# EAGLE design dwm1000v2 (EAGLE 8.3.2)
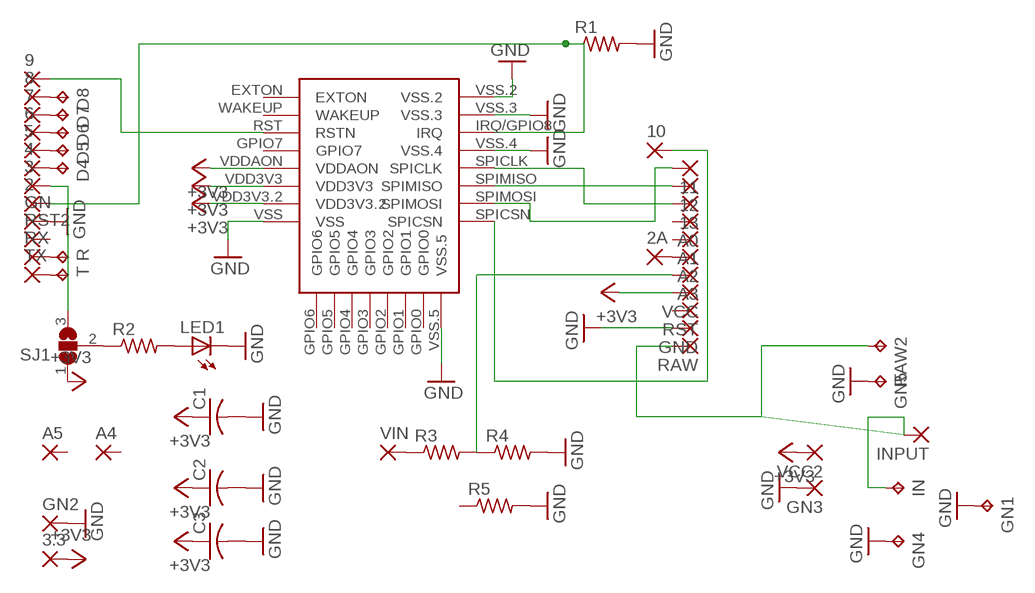
[diagram p0: schematic, sheet 1]

## Parts
2  SMD2  [SMD1,27-2,54]
2A  SMD2  [SMD1,27-2,54]
3  SMD2  [SMD1,27-2,54]
3.3  SMD2  [SMD1,27-2,54]
4  SMD2  [SMD1,27-2,54]
5  SMD2  [SMD1,27-2,54]
6  SMD2  [SMD1,27-2,54]
7  SMD2  [SMD1,27-2,54]
8  SMD2  [SMD1,27-2,54]
9  SMD2  [SMD1,27-2,54]
10  SMD2  [SMD1,27-2,54]
11  SMD2  [SMD1,27-2,54]
12  SMD2  [SMD1,27-2,54]
13  SMD2  [SMD1,27-2,54]
A0  SMD2  [SMD1,27-2,54]
A1  SMD2  [SMD1,27-2,54]
A2  SMD2  [SMD1,27-2,54]
A3  SMD2  [SMD1,27-2,54]
A4  1,6/0,8  [1,6/0,8]
A5  1,6/0,8  [1,6/0,8]
C1  C-USC0805  [C0805]
C2  C-USC0805  [C0805]
C3  C-USC0805  [C0805]
D4  TPTP12SQ  [TP12SQ]
D5  TPTP12SQ  [TP12SQ]
D6  TPTP12SQ  [TP12SQ]
D7  TPTP12SQ  [TP12SQ]
D8  TPTP12SQ  [TP12SQ]
GN  SMD2  [SMD1,27-2,54]
GN1  TPTP13SQ  [TP13SQ]
GN2  SMD2  [SMD1,27-2,54]
GN3  SMD2  [SMD1,27-2,54]
GN4  TPTP13SQ  [TP13SQ]
GN5  TPTP13SQ  [TP13SQ]
GND  SMD2  [SMD1,27-2,54]
IN  TPTP13SQ  [TP13SQ]
INPUT  SMD2  [SMD1,27-2,54]
LED1  LEDCHIPLED_0805  [CHIPLED_0805]
R  TPTP12SQ  [TP12SQ]
R1  R-US_R0603  [R0603]
R2  R-US_M0805  [M0805]
R3  R-US_R0805  [R0805]
R4  R-US_R0805  [R0805]
R5  R-US_R0805  [R0805]
RAW  SMD2  [SMD1,27-2,54]
RAW2  TPTP13SQ  [TP13SQ]
RST  SMD2  [SMD1,27-2,54]
RST2  SMD2  [SMD1,27-2,54]
RX  SMD2  [SMD1,27-2,54]
SJ1  SJ2W  [SJ_2]
T  TPTP12SQ  [TP12SQ]
TX  SMD2  [SMD1,27-2,54]
U$1  DWM1000  [DWM1000]
VCC  SMD2  [SMD1,27-2,54]
VCC2  SMD2  [SMD1,27-2,54]
VIN  SMD2  [SMD1,27-2,54]

## Nets
+3V3: 3.3.1(P) C1.1 C2.1 C3.1 SJ1.1 U$1.VDD3V3 U$1.VDD3V3.2 U$1.VDDAON VCC2.1(P) VCC.1(P)
GND: C1.2 C2.2 C3.2 GN1.TP GN2.1(P) GN3.1(P) GN4.TP GN5.TP GN.1(P) GND.1(P) LED1.C R1.2 R4.2 R5.2 U$1.VSS U$1.VSS.2 U$1.VSS.3 U$1.VSS.4 U$1.VSS.5
N$1: 10.1(P) U$1.SPICSN
N$2: 9.1(P) U$1.RST(RSTN)
N$3: 12.1(P) U$1.SPIMISO
N$4: 11.1(P) U$1.SPIMOSI
N$5: 13.1(P) U$1.SPICLK
N$6: 2.1(P) R1.1 U$1.IRQ/GPIO8(IRQ)
N$7: LED1.A R2.2
N$8: R2.1 SJ1.2
N$9: 3.1(P) SJ1.3
N$10: IN.TP INPUT.1(P) RAW2.TP RAW.1(P)
N$11: A3.1(P) R3.2 R4.1
N$12: R3.1 VIN.1(P)
N$13: 2A.1(P) A2.1(P)
N$15: 7.1(P) D7.TP
N$16: 6.1(P) D6.TP
N$17: 5.1(P) D5.TP
N$18: 4.1(P) D4.TP
N$19: R.TP RX.1(P)
N$20: T.TP TX.1(P)
N$21: 8.1(P) D8.TP
Unconnected: A0.1(P) A1.1(P) A4.1(P) A5.1(P) R5.1 RST2.1(P) RST.1(P) U$1.EXTON U$1.GPIO0 U$1.GPIO1 U$1.GPIO2 U$1.GPIO3 U$1.GPIO4 U$1.GPIO5 U$1.GPIO6 U$1.GPIO7 U$1.WAKEUP

## Library data of the parts
2 2A 3 3.3 4-13 A0 A1-A3 GN GN2 GN3 GND INPUT RAW RST RST2 RX TX VCC VCC2 VIN = wirepad:SMD2: SMD PAD
A4 A5 = wirepad:1,6/0,8: THROUGH-HOLE PAD
C1-C3 = adafruit:C-US: CAPACITOR, American symbol
D4-D8 GN1 GN4 GN5 IN R RAW2 T = testpad:TP: Test pad
LED1 = adafruit:LED: LED OSRAM: - CHIPLED LG R971, LG N971, LY N971, LG Q971, LY Q971, LO R971, LY R971 LH N974, LH R974 LS Q976, LO Q976, LY Q976 LO Q996 - Hyper CHIPLED LW Q18S LB Q993, LB Q99A, LB R99A - SideLED LS A670, LO A670, LY A670, LG A670, LP A670 LB A673, LV A673, LT A673, LW A673 LH A674 LY A675 LS A676, LA A676, LO A676, LY A676, LW A676 LS A679, LY A679, LG A679 - Hyper Micro SIDELED® LS Y876, LA Y876, LO Y876, LY Y876 LT Y87S - SmartLED LW L88C, LW L88S LB L89C, LB L89S, LG L890 LS L89K, LO L89K, LY L89K LS L896, LA L896, LO L896, LY L896 - TOPLED LS T670, LO T670, LY T670, LG T670, LP T670 LSG T670, LSP T670, LSY T670, LOP T670, LYG T670 LG T671, LOG T671, LSG T671 LB T673, LV T673, LT T673, LW T673 LH T674 LS T676, LA T676, LO T676, LY T676, LB T676, LH T676, LSB T676, LW T676 LB T67C, LV T67C, LT T67C, LS T67K, LO T67K, LY T67K, LW E67C LS E67B, LA E67B, LO E67B, LY E67B, LB E67C, LV E67C, LT E67C LW T67C LS T679, LY T679, LG T679 LS T770, LO T770, LY T770, LG T770, LP T770 LB T773, LV T773, LT T773, LW T773 LH T774 LS E675, LA E675, LY E675, LS T675 LS T776, LA T776, LO T776, LY T776, LB T776 LHGB T686 LT T68C, LB T68C - Hyper Mini TOPLED® LB M676 - Mini TOPLED Santana® LG M470 LS M47K, LO M47K, LY M47K Source: http://www.osram.convergy.de/
R1-R5 = adafruit:R-US_: RESISTOR, American symbol
SJ1 = jumper:SJ2W: SMD solder JUMPER
U$1 = dwm1000:DWM1000

## Board
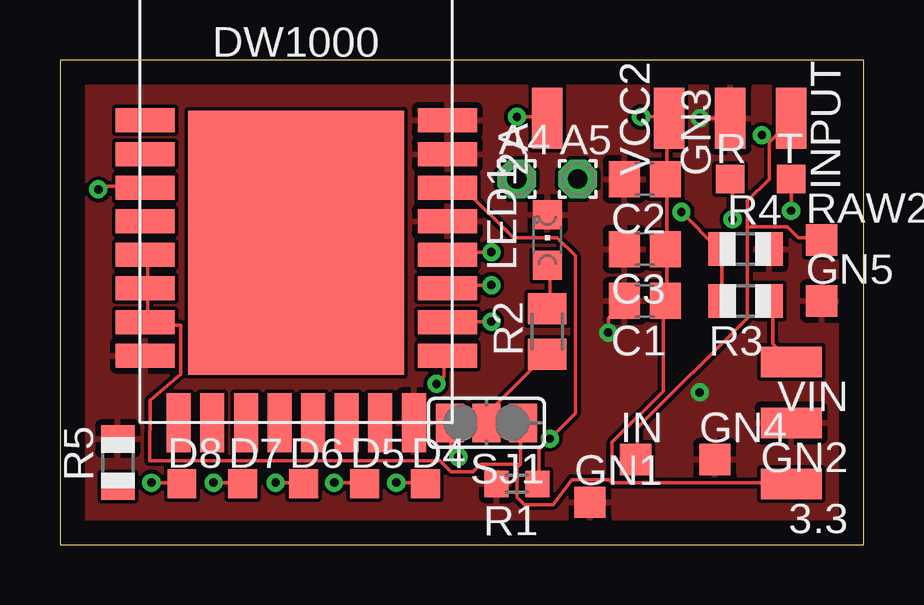
[diagram p1: board, top side]
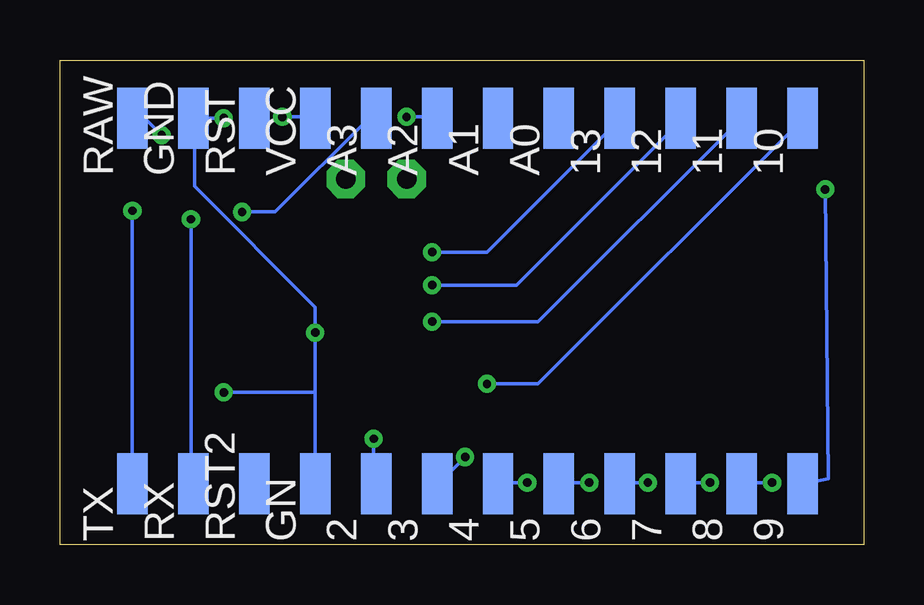
[diagram p2: board, bottom side, seen from below]

Size 33.5 x 20.2 mm. Coordinates in mm from the lower left corner, seen from the top.
Outline: 0,0 33.5,0 33.5,20.2 0,20.2 0,0
Copper layers (1*16): Top 0.035mm / dielectric 1.5mm / Bottom 0.035mm
Design rules "default": minimum track width 6mil, minimum drill 0.35mm, track to track 6mil, track to pad 6mil, pad to pad 6mil, via to via 6mil, smd to smd 6mil, copper to edge 40mil, drill to drill 6mil, minimum pad ring 10mil, minimum via ring 8mil, stop-mask expansion 4mil, vias tented up to drill 0mil, thermal gap 10mil

### Footprints (pad centres in the part's own frame; a part is rotated, then mirrored left to right if it is on the bottom)
SMD1,27-2,54 = smd 1.27 x 2.54: 1 0,0
1,6/0,8 = drill 0.813 pad 1.6 octagon: 1 0,0
C0805 = smd 1.3 x 1.5: 1 -0.85,0; 2 0.85,0
TP12SQ = smd 1.2 x 1.2: TP 0,0
TP13SQ = smd 1.3 x 1.3: TP 0,0
CHIPLED_0805 = smd 1.2 x 1.2: A 0,-1.05; C 0,1.05
R0603 = smd 1 x 1.1: 1 -0.85,0; 2 0.85,0
M0805 = smd 1.3 x 1.6: 1 -0.95,0; 2 0.95,0
R0805 = smd 1.1 x 1.4: 1 -1,0; 2 1,0
SJ_2 = smd 1.168 x 1.6: 1 -1.524,0; 2 0,0; 3 1.524,0
DWM1000 = smd 2.45 x 1: EXTON -2.8,12.6; GPIO7 -2.8,8.4; IRQ/GPIO8 9.8,9.8; RST -2.8,9.8; SPICLK 9.8,7; SPICSN 9.8,2.8; SPIMISO 9.8,5.6; SPIMOSI 9.8,4.2; VDD3V3 -2.8,4.2; VDD3V3.2 -2.8,5.6; VDDAON -2.8,7; VSS -2.8,2.8; VSS.2 9.8,12.6; VSS.3 9.8,11.2; VSS.4 9.8,8.4; WAKEUP -2.8,11.2 | smd 9 x 11: GND 3.5,7.5 | smd 1 x 2.45: GPIO0 7,0; GPIO1 5.6,0; GPIO2 4.2,0; GPIO3 2.8,0; GPIO4 1.4,0; GPIO5 0,0; GPIO6 -1.4,0; VSS.5 8.4,0

### Placement (x,y rotation side)
2  20.32,2.54 0 bottom
2A  20.32,17.78 0 top
3  17.78,2.54 0 bottom
3.3  30.48,2.54 90 top
4  15.24,2.54 0 bottom
5  12.7,2.54 0 bottom
6  10.16,2.54 0 bottom
7  7.62,2.54 0 bottom
8  5.08,2.54 0 bottom
9  2.54,2.54 0 bottom
10  2.54,17.78 0 bottom
11  5.08,17.78 0 bottom
12  7.62,17.78 0 bottom
13  10.16,17.78 0 bottom
A0  12.7,17.78 0 bottom
A1  15.24,17.78 0 bottom
A2  17.78,17.78 0 bottom
A3  20.32,17.78 0 bottom
A4  19.05,15.24 0 top
A5  21.59,15.24 0 top
C1  24.38,10.16 180 top
C2  24.38,15.24 180 top
C3  24.38,12.32 180 top
D4  15.24,2.54 0 top
D5  12.7,2.54 0 top
D6  10.16,2.54 0 top
D7  7.62,2.54 0 top
D8  5.08,2.54 0 top
GN  22.86,2.54 0 bottom
GN1  22.1,1.78 0 top
GN2  30.48,5.08 90 top
GN3  27.94,17.78 0 top
GN4  27.3,3.56 0 top
GN5  31.75,10.16 0 top
GND  27.94,17.78 0 bottom
IN  24,3.56 0 top
INPUT  30.48,17.78 180 top
LED1  20.32,12.7 0 top
R  27.94,15.24 0 top
R1  19.05,2.54 180 top
R2  20.32,8.89 90 top
R3  28.57,10.16 180 top
R4  28.57,12.32 0 top
R5  2.41,3.43 90 top
RAW  30.48,17.78 0 bottom
RAW2  31.75,12.7 0 top
RST  25.4,17.78 0 bottom
RST2  25.4,2.54 0 bottom
RX  27.94,2.54 0 bottom
SJ1  17.78,5.08 180 top
T  30.48,15.24 0 top
TX  30.48,2.54 0 bottom
U$1  6.35,5.08 0 top
VCC  22.86,17.78 0 bottom
VCC2  25.4,17.78 0 top
VIN  30.48,7.62 90 top

### Tracks (layer width: path | path; a pad name or v marks a point on that pad's centre or on a via)
+3V3  (via drill 0.35)
  Top 0.152: 25.3,15.24 25.3,17.68 VCC2.1 25.3,17.83 v24.23,17.83 | 25.3,15.24 25.3,12.34 C3.1 25.3,12.19 25.3,10.21 C1.1 25.15,10.06 25.15,6.4 23.01,4.27 23.01,2.59 | 25.3,15.24 C2.1 | U$1.VDDAON 3.66,12.04 3.66,10.82 U$1.VDD3V3.2 3.66,10.67 3.66,9.3 U$1.VDD3V3 3.5,9.14 5.03,9.14 5.03,7.11 3.76,6.02 3.73,3.5 15.85,3.5 16.31,3.05 17.22,3.05 17.53,3.35 19.2,3.35 | 19.2,3.35 19.2,5.03 SJ1.1 | 19.2,3.35 19.05,3.2 19.05,1.98 19.36,1.68 20.55,1.68 21.34,2.72 22.89,2.72 23.01,2.59 | 23.01,2.59 30.48,2.59 3.3.1
  Bottom 0.152: v24.23,17.83 22.86,17.83 VCC.1
GND  (via drill 0.35)
  Top 0.152: v22.86,8.84 22.86,9.45 23.47,10.06 C1.2 | 16.15,16.46 U$1.VSS.3 | v26.67,17.78 GN3.1
  Bottom 0.152: 22.86,6.35 v22.86,8.84 22.86,9.91 27.89,14.94 27.89,17.68 | 22.86,6.35 GN.1 | 27.89,17.68 GN3.1 | 22.86,6.35 v26.67,6.35 | v26.67,17.78 27.79,17.78 27.89,17.68
  pour Top: 0,20.32 35.56,20.32 35.56,-1.27 0,-1.27
N$1  (via drill 0.35)
  Top 0.152: v15.7,6.71 16,7.01 16,7.77 U$1.SPICSN
  Bottom 0.152: v15.7,6.71 13.56,6.71 2.59,17.68 10.1
N$2  (via drill 0.35)
  Top 0.152: 4.42,14.78 3.66,14.78 U$1.RST 3.5,14.94 1.68,14.94 v1.6,14.81
  Bottom 0.152: v1.6,14.81 1.47,2.74 9.1
N$3  (via drill 0.35)
  Top 0.152: v17.98,10.82 16.15,10.82 U$1.SPIMISO
  Bottom 0.152: v17.98,10.82 14.48,10.82 7.62,17.68 12.1
N$4  (via drill 0.35)
  Top 0.152: v17.98,9.3 16.15,9.3 U$1.SPIMOSI
  Bottom 0.152: v17.98,9.3 13.56,9.3 11.1
N$5  (via drill 0.35)
  Top 0.152: v17.98,12.19 16.15,12.19 U$1.SPICLK
  Bottom 0.152: v17.98,12.19 15.7,12.19 10.21,17.68 13.1
N$6  (via drill 0.35)
  Top 0.152: R1.1 19.96,2.59 19.96,3.96 v20.42,4.42 21.49,5.49 21.49,12.04 20.73,12.8 18.9,12.8 16.92,14.78 16.15,14.78 U$1.IRQ/GPIO8
  Bottom 0.152: v20.42,4.42 20.42,2.59 2.1
N$7
  Top 0.152: LED1.A 20.42,11.58 20.42,9.91 R2.2
N$8
  Top 0.152: R2.1 20.27,7.92 17.83,5.49 17.83,5.18 SJ1.2
N$9  (via drill 0.35)
  Top 0.152: v16.61,3.66 16.31,3.96 16.31,5.03 SJ1.3
  Bottom 0.152: v16.61,3.66 17.68,2.59 3.1
N$10  (via drill 0.35)
  Top 0.152: 28.65,13.26 28.65,14.33 29.57,15.24 29.57,16.76 | 28.65,13.26 28.65,9.45 24.08,4.88 24.08,3.66 IN.TP | 29.57,16.76 30.48,17.68 INPUT.1 | 29.57,16.76 v29.26,17.07 | 28.65,13.26 30.33,13.26 30.79,12.8 31.7,12.8 RAW2.TP
  Bottom 0.152: v29.26,17.07 29.87,17.68 30.48,17.68 INPUT.1
N$11  (via drill 0.35)
  Top 0.152: R3.2 27.58,10.21 27.58,12.19 R4.1 27.43,12.34 v25.91,13.87
  Bottom 0.152: v25.91,13.87 24.54,13.87 20.73,17.68 20.42,17.68 A3.1
N$12
  Top 0.152: VIN.1 29.72,8.38 29.72,10.06 R3.1
N$13  (via drill 0.35)
  Top 0.152: v19.05,17.83 20.27,17.83 2A.1
  Bottom 0.152: v19.05,17.83 17.83,17.83 A2.1
N$15  (via drill 0.35)
  Top 0.152: v6.4,2.59 7.62,2.59 D7.TP
  Bottom 0.152: v6.4,2.59 7.62,2.59 D7.TP
N$16  (via drill 0.35)
  Top 0.152: v8.99,2.59 10.06,2.59 D6.TP
  Bottom 0.152: v8.99,2.59 10.06,2.59 D6.TP
N$17  (via drill 0.35)
  Top 0.152: v11.43,2.59 12.65,2.59 D5.TP
  Bottom 0.152: v11.43,2.59 12.65,2.59 D5.TP
N$18  (via drill 0.35)
  Top 0.152: v14.02,2.59 15.24,2.59 D4.TP
  Bottom 0.152: v14.02,2.59 15.24,2.59 D4.TP
N$19  (via drill 0.35)
  Top 0.152: v28.04,13.56 28.04,15.24 R.TP
  Bottom 0.152: v28.04,13.56 28.04,2.59 RX.1
N$20  (via drill 0.35)
  Top 0.152: v30.48,13.92 T.TP
  Bottom 0.152: TX.1 v30.48,13.92
N$21  (via drill 0.35)
  Top 0.152: v3.81,2.59 5.03,2.59 D8.TP
  Bottom 0.152: v3.81,2.59 5.03,2.59 D8.TP